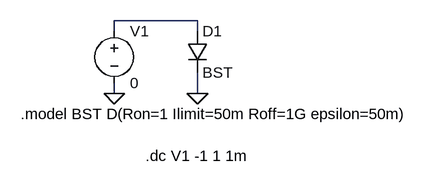
[diagram p0: schematic Draft2.asc]
Draft2.asc, the LTspice schematic file:
Version 4
SHEET 1 880 680
WIRE 288 32 160 32
WIRE 160 48 160 32
WIRE 288 48 288 32
WIRE 160 144 160 128
WIRE 288 144 288 112
FLAG 160 144 0
FLAG 288 144 0
SYMBOL diode 272 48 R0
SYMATTR InstName D1
SYMATTR Value BST
SYMBOL voltage 160 32 R0
SYMATTR InstName V1
SYMATTR Value 0
TEXT 16 176 Left 2 !.model BST D(Ron=1 Ilimit=50m Roff=1G epsilon=50m)
TEXT 208 240 Left 2 !.dc V1 -1 1 1m

The netlist it stands for:
* Draft2.asc
D1 N001 0 BST
V1 N001 0 0
.model D D
.lib standard.dio
.model BST D(Ron=1 Ilimit=50m Roff=1G epsilon=50m)
.dc V1 -1 1 1m
.backanno
.end